# EasyEDA Pro project ProPrj_terminal-bus_2024-09-02.epro

# Schematic Schematic1
Board Name: Board1; Create Date: 2024-08-30
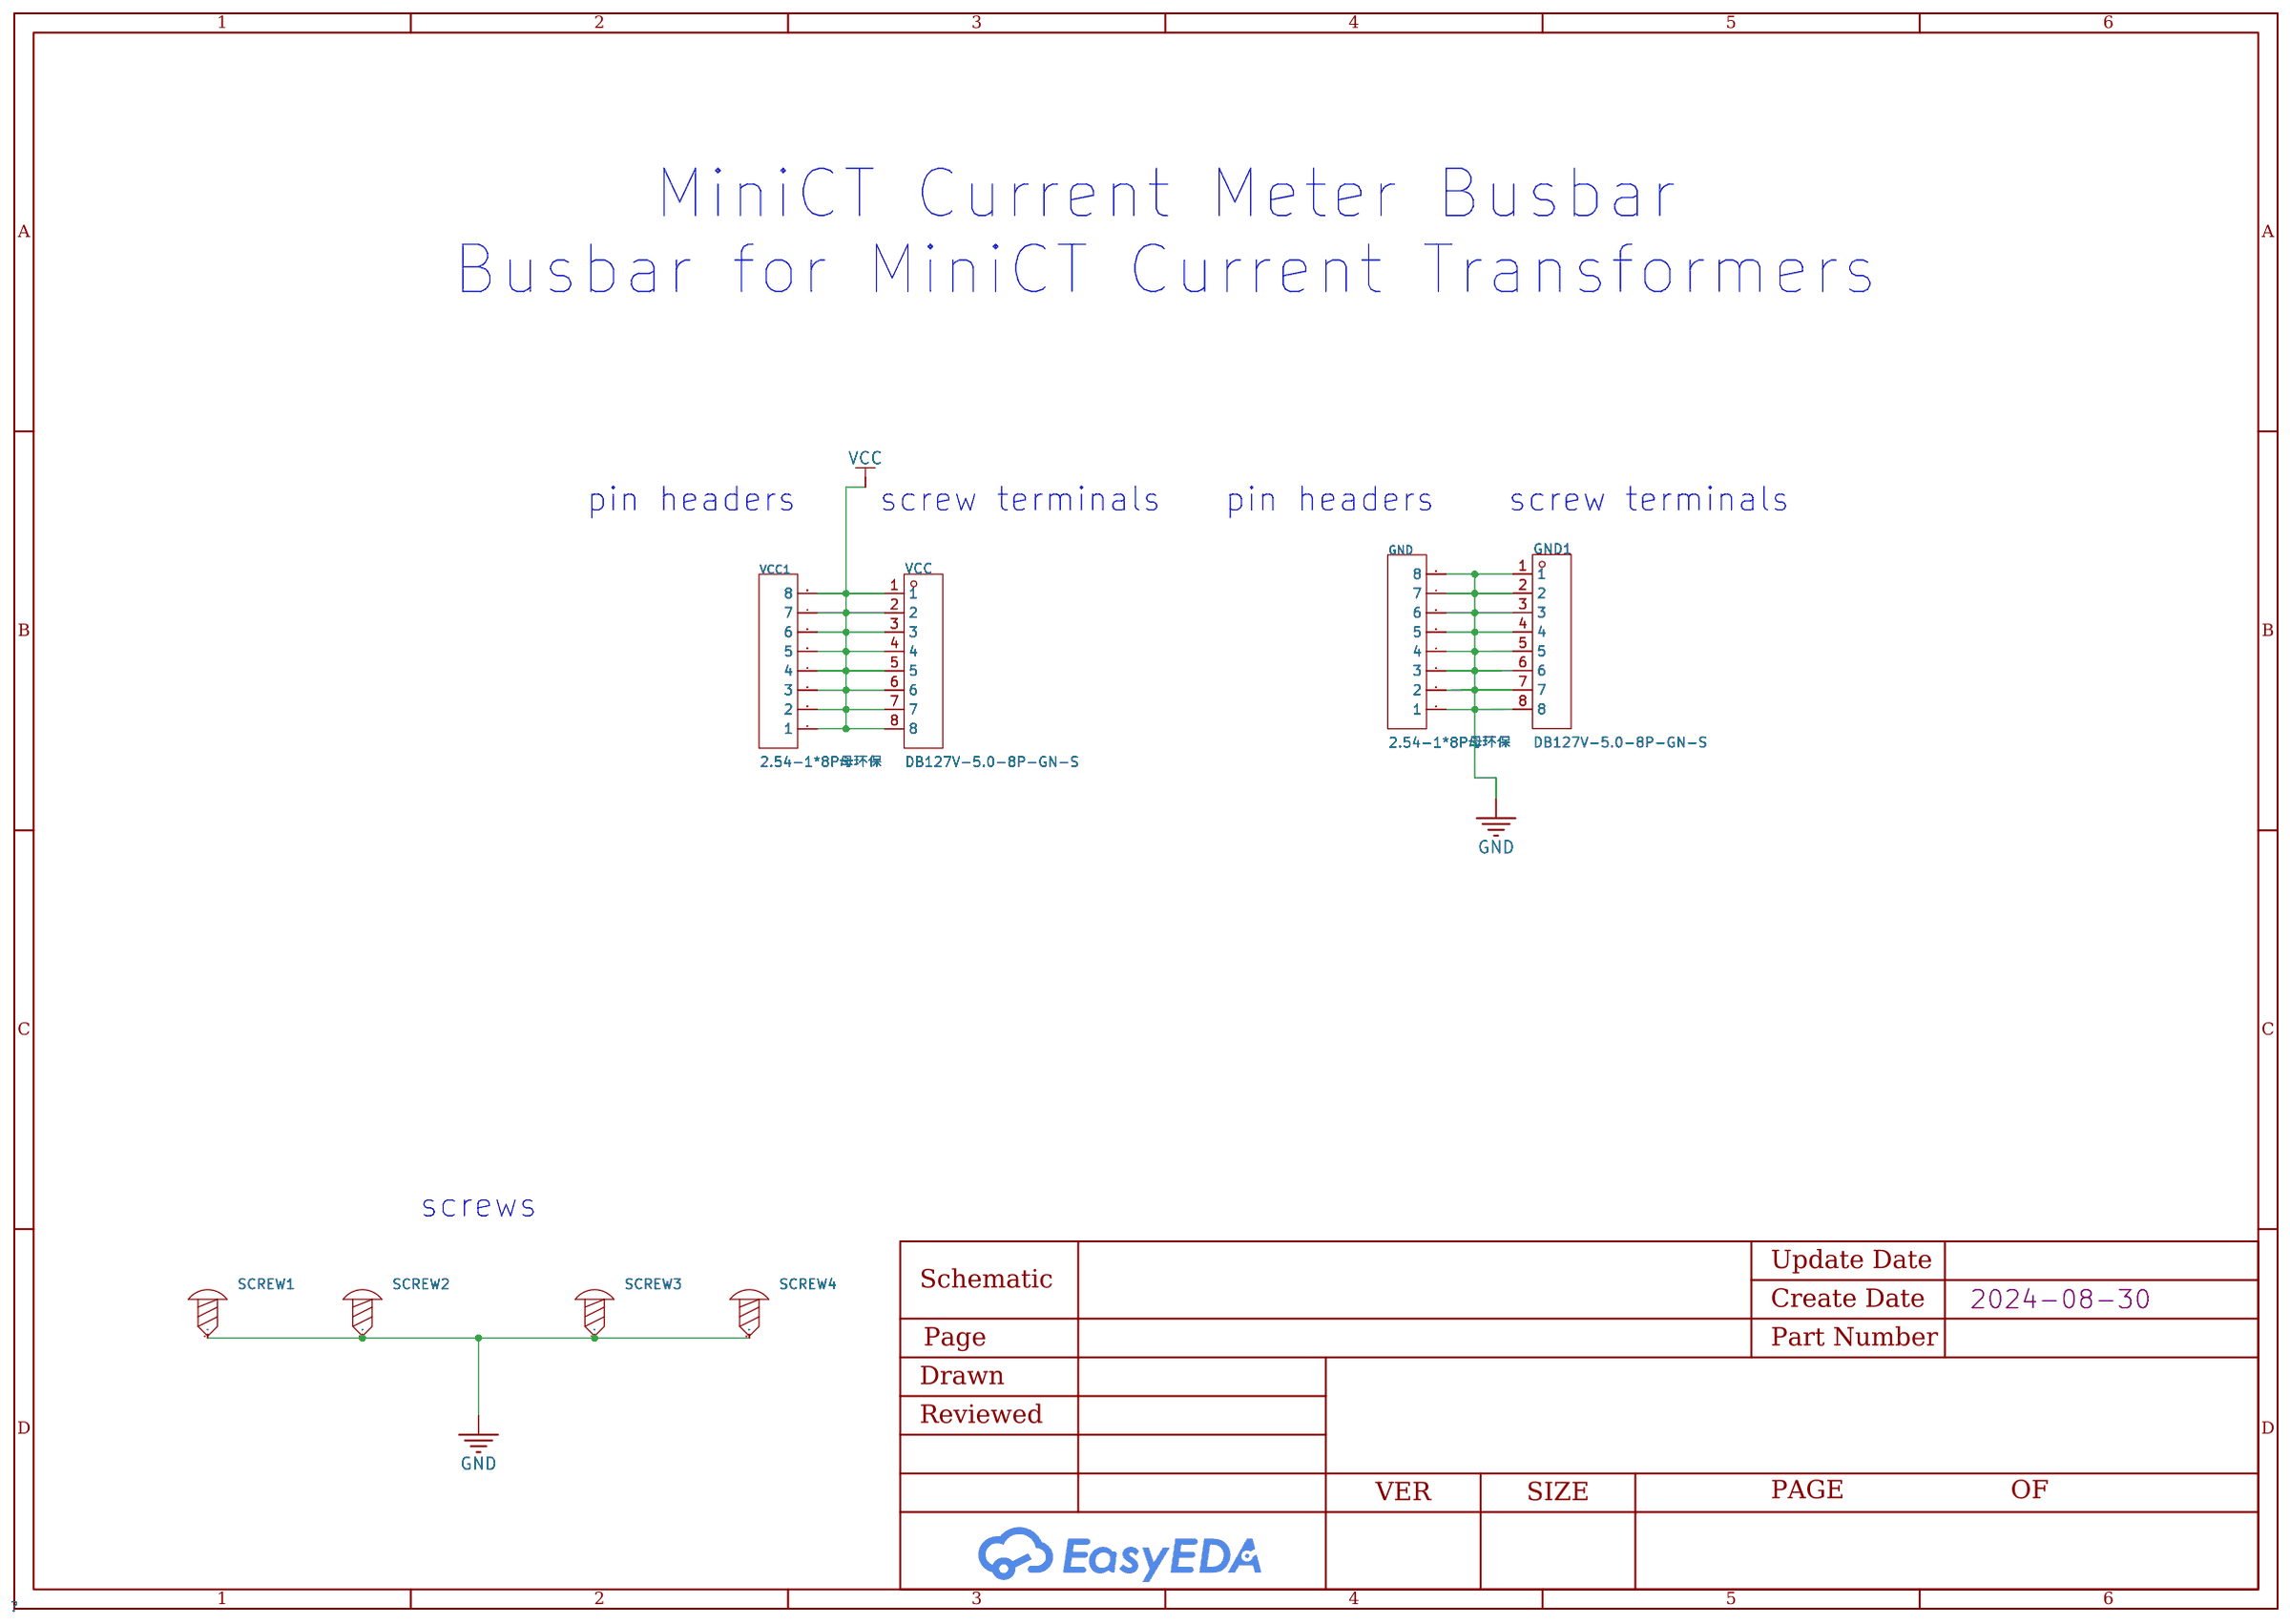
[diagram p0: schematic sheet]

## Parts
GND  2.54-1*8P母环保  [HDR-TH_8P-P2.54-V-F-1]
GND1  DB127V-5.0-8P-GN-S  [CONN-TH_8P-P5.00_DB127V-5.0-8P-GN-S]
SCREW1  -  [Screw-Hole-M2]
SCREW2  -  [Screw-Hole-M2]
SCREW3  -  [Screw-Hole-M2]
SCREW4  -  [Screw-Hole-M2]
VCC  DB127V-5.0-8P-GN-S  [CONN-TH_8P-P5.00_DB127V-5.0-8P-GN-S]
VCC1  2.54-1*8P母环保  [HDR-TH_8P-P2.54-V-F-1]

## Library data of the parts
GND VCC1 = 2.54-1*8P母环保: Holes Structure:1x8P Pitch:2.54mm Row Spacing:- Mounting Type:Straight Number of Rows:Plugin Number of Holes:8P Insulation Height:- Contact Material:- Contact Plating:-; LCSC Part Name: 间距:2.54mm 1x8P 直插; Supplier Part: C27438; Manufacturer: BOOMELE(博穆精密); Supplier Footprint: 插件,P=2.54mm; Datasheet: https://atta.szlcsc.com/upload/public/pdf/source/20231221/1CA800C6799ED97958773716FAA1BFFE.pdf; Supplier: LCSC; Holes Structure: 1x8P; Pitch: 2.54mm; Mounting Type: Straight; Number of Rows: Plugin; Number of Holes: 8P
GND1 VCC = DB127V-5.0-8P-GN-S: Structure:1x8P Pitch:5mm Color:Green Mounting Style:Straight Current Rating (Max):15A Voltage Rating (Max):250V Number of Pins:8P Number of Rows:1 Wire Gauge - AWG:14~26 Wire Gauge - AWG:14~26 Wire Gauge - mm2:1.5 Wire Gauge - mm2:1.5 Number of PINs Per R; LCSC Part Name: 5mm 1x8P 排数:1 每排P数:8 直插; Supplier Part: C430626; Manufacturer: DORABO(地博电气); Supplier Footprint: 插件,P=5mm; JLCPCB Part Class: Extended Part; Datasheet: https://atta.szlcsc.com/upload/public/pdf/source/20230106/9CDB472D403F670588C42D375AEF1B30.pdf; Supplier: LCSC; Structure: 1x8P; Pitch: 5mm; Color: Green; Mounting Style: Straight; Current Rating (Max): 15A; Voltage Rating (Max): 250V; Number of Pins: 8P; Number of Rows: 1; Wire Gauge - AWG: 14~26; Wire Gauge - mm2: 1.5; Number of PINs Per Row: 8; Operating Temperature Range: -40℃~+105℃
SCREW1-SCREW4 = Screw-Hole-M2: Supplier Footprint: 插件

## Nets
GND: GND.1 GND.2 GND.3 GND.4 GND.5 GND.6 GND.7 GND.8 GND1.5 GND1.6 GND1.7 GND1.8 SCREW1.1 SCREW2.1 SCREW3.1 SCREW4.1
VCC: VCC.1 VCC.2 VCC.3 VCC.4 VCC.5 VCC.6 VCC.7 VCC.8 VCC1.1 VCC1.2 VCC1.3 VCC1.4 VCC1.5 VCC1.6 VCC1.7 VCC1.8

Not connected (* = marked no-connect by the designer): GND1 1 2 3 4

## Notes on the sheet
- MiniCT Current Meter Busbar
  Busbar for MiniCT Current Transformers
- pin headers
- screw terminals
- pin headers
- screw terminals
- screws

# Board buscardPCB
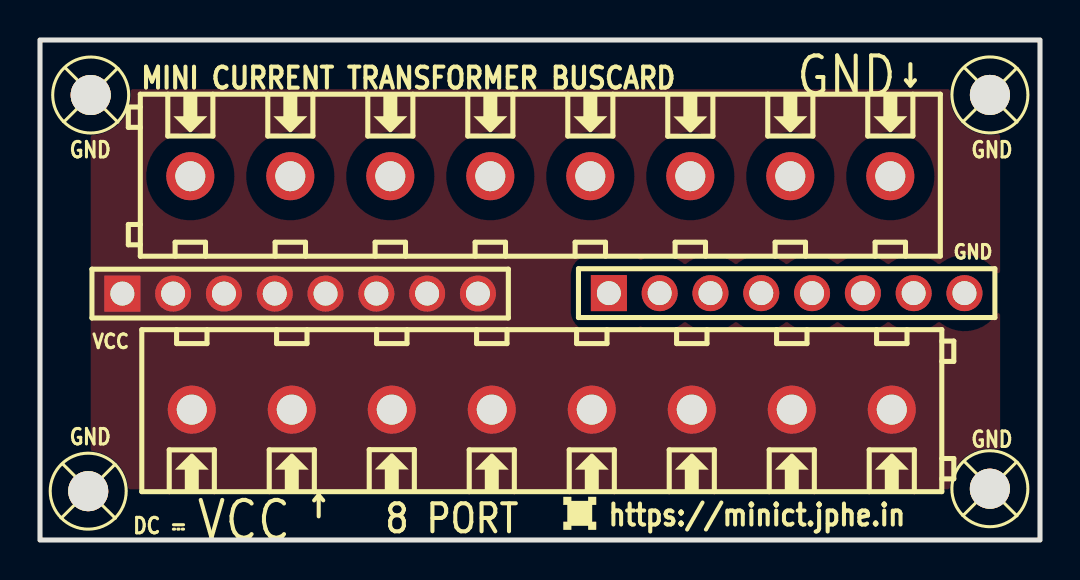
[diagram p1: board, top side]
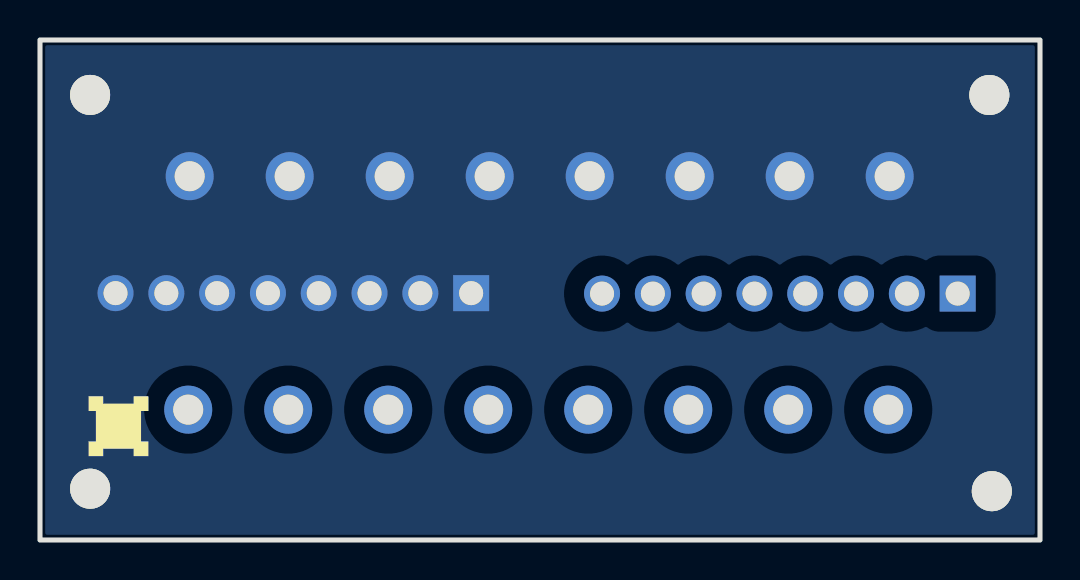
[diagram p2: board, bottom side, seen from below]

Outline 50 x 25 mm; copper layers: Top Layer, Bottom Layer. Coordinates in mm from the lower left corner of the outline.
Outline path: rectangle 0,25 50,0
Stack: Top Layer 0.035mm / Dielectric1 1.51mm FR4 er 4.5 / Bottom Layer 0.035mm

## Design rules (mm)
template: Custom Config
spacing copperThickness1oz (default): track to track 0.102, other pairs 0.152 to 0.3
spacing copperThickness2oz: track to track 0.203, other pairs 0.152 to 0.3
track width copperThickness1oz (default): min 0.127, default 0.254, max 2.54
track width copperThickness2oz: min 0.203, default 0.254, max 2.54
differential pair differentialPair (default): width min 0.127, default 0.254, max 2.54; gap min 0.152, default 0.152
via viaSize (default): diameter min 0.5, default 0.61, max 10; hole min 0.3, default 0.305, max 6.3
net GND uses copperRegion1
pour e676 uses copperRegion1

## Placement (name value [footprint] x y rotation side)
GND  2.54-1*8P母环保  [HDR-TH_8P-P2.54-V-F-1]  37.33 12.34 0 top
GND1  DB127V-5.0-8P-GN-S  [CONN-TH_8P-P5.00_DB127V-5.0-8P-GN-S]  25.02 18.19 180 top
SCREW1  -  [Screw-Hole-M2]  2.54 22.25 0 top
SCREW2  -  [Screw-Hole-M2]  47.49 2.56 0 top
SCREW3  -  [Screw-Hole-M2]  2.41 2.44 0 top
SCREW4  -  [Screw-Hole-M2]  47.5 22.25 0 top
VCC  DB127V-5.0-8P-GN-S  [CONN-TH_8P-P5.00_DB127V-5.0-8P-GN-S]  25.09 6.52 0 top
VCC1  2.54-1*8P母环保  [HDR-TH_8P-P2.54-V-F-1]  13.01 12.32 0 top

## Footprints (pads in the part's own frame, mm; a bottom-side part is the same pattern mirrored in y, then rotated)
CONN-TH_8P-P5.00_DB127V-5.0-8P-GN-S
  round 2.4 hole 1.5: 1(-17.5,0) 2(-12.5,0) 3(-7.5,0) 4(-2.5,0) 5(2.5,0) 6(7.5,0) 7(12.5,0) 8(17.5,0)
HDR-TH_8P-P2.54-V-F-1
  rect 1.8x1.8 hole 1.2: 1(-8.89,0)
  round 1.8 hole 1.2: 2(-6.35,0) 3(-3.81,0) 4(-1.27,0) 5(1.27,0) 6(3.81,0) 7(6.35,0) 8(8.89,0)
Screw-Hole-M2
  round 2 hole 2: 1(0,0)

## Nets
GND: GND.1 GND.2 GND.3 GND.4 GND.5 GND.6 GND.7 GND.8 GND1.1 GND1.2 GND1.3 GND1.4 GND1.5 GND1.6 GND1.7 GND1.8 SCREW1.1 SCREW2.1 SCREW3.1 SCREW4.1
VCC: VCC.1 VCC.2 VCC.3 VCC.4 VCC.5 VCC.6 VCC.7 VCC.8 VCC1.1 VCC1.2 VCC1.3 VCC1.4 VCC1.5 VCC1.6 VCC1.7 VCC1.8

## Copper pours and planes (outline as drawn; the poured copper is in the pictures)
GND on Bottom Layer: -2.54,27.05 51.56,27.05 51.56,-1.4 -2.54,-1.4
VCC on Top Layer: 2.54,22.54 48.01,22.54 48.01,2.54 2.54,2.54

## Text on the board
Top Silkscreen Layer: GND | MINI CURRENT TRANSFORMER BUSCARD | https://minict.jphe.in | 8 PORT | VCC | DC ⎓ | ↓
